# EAGLE design S0R (EAGLE 9.0.0)
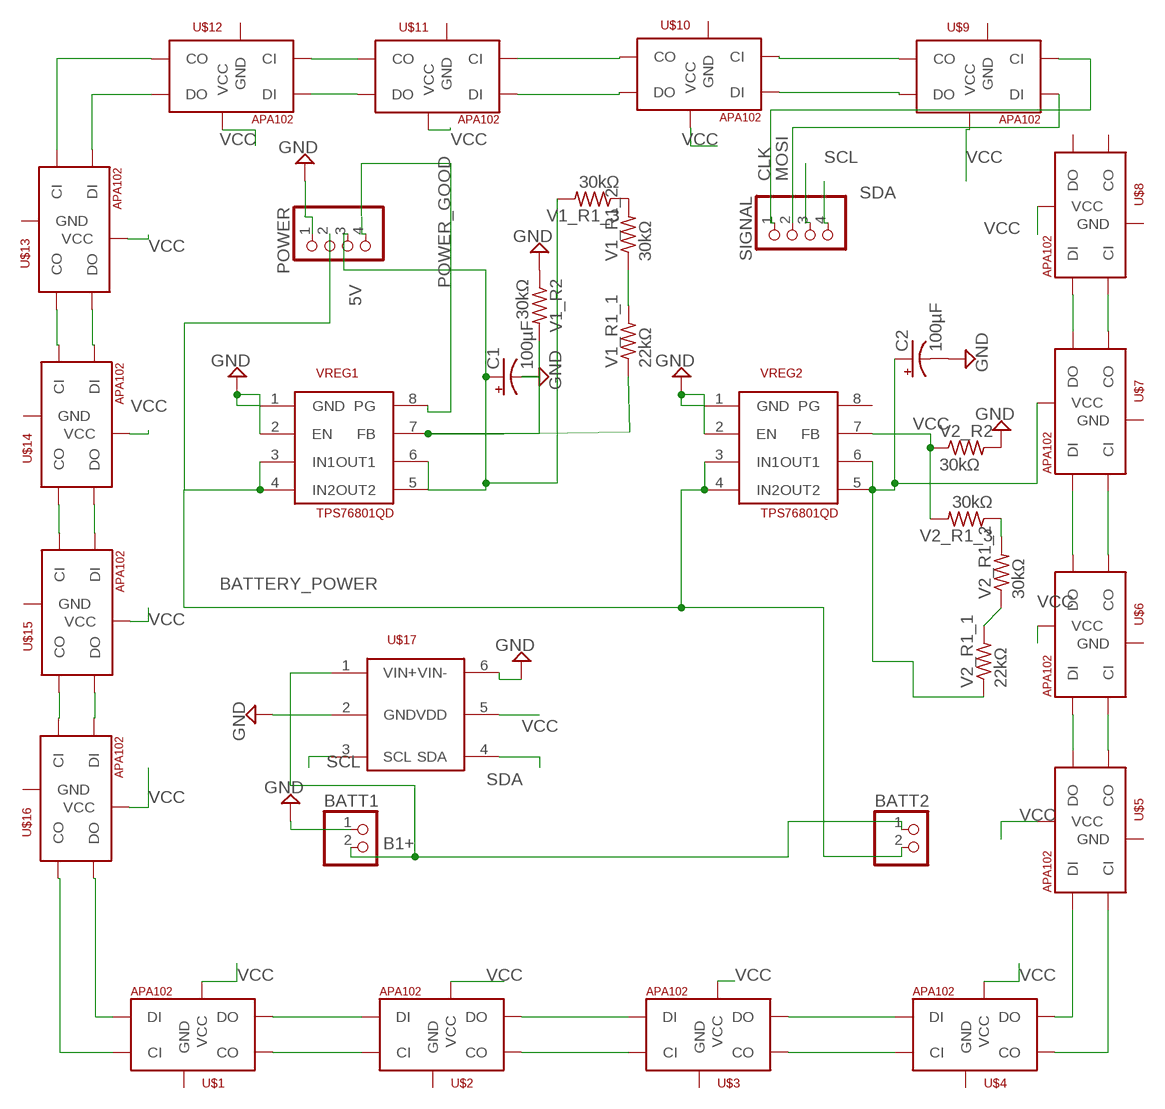
[diagram p0: schematic, sheet 1]

## Parts
BATT1  PINHD-1X2/90  [1X02/90]
BATT2  PINHD-1X2/90  [1X02/90]
C1  100µF  CPOL-USD/7343-31R  [D/7343-31R]
C2  100µF  CPOL-USD/7343-31R  [D/7343-31R]
POWER  PINHD-1X4  [1X04]
SIGNAL  PINHD-1X4  [1X04]
U$1  APA1025050  [APA102_5050]
U$2  APA1025050  [APA102_5050]
U$3  APA1025050  [APA102_5050]
U$4  APA1025050  [APA102_5050]
U$5  APA1025050  [APA102_5050]
U$6  APA1025050  [APA102_5050]
U$7  APA1025050  [APA102_5050]
U$8  APA1025050  [APA102_5050]
U$9  APA1025050  [APA102_5050]
U$10  APA1025050  [APA102_5050]
U$11  APA1025050  [APA102_5050]
U$12  APA1025050  [APA102_5050]
U$13  APA1025050  [APA102_5050]
U$14  APA1025050  [APA102_5050]
U$15  APA1025050  [APA102_5050]
U$16  APA1025050  [APA102_5050]
U$17  ADS1000BD0  [SOT-23-6-DBV]
V1_R1_1  22kΩ  R-US_R0402  [R0402]
V1_R1_2  30kΩ  R-US_M1206  [M1206]
V1_R1_3  30kΩ  R-US_M1206  [M1206]
V1_R2  30kΩ  R-US_M1206  [M1206]
V2_R1_1  22kΩ  R-US_R0402  [R0402]
V2_R1_2  30kΩ  R-US_M1206  [M1206]
V2_R1_3  30kΩ  R-US_M1206  [M1206]
V2_R2  30kΩ  R-US_M1206  [M1206]
VREG1  TPS76801QD  [SO-8_POWERPAD]
VREG2  TPS76801QD  [SO-8_POWERPAD]

## Nets
5V: C1.+ POWER.3 V1_R1_3.2 VREG1.5(OUT2) VREG1.6(OUT1)
B1+: BATT1.2 BATT2.1 U$17.1(VIN+)
BATTERY_POWER: BATT2.2 POWER.2 VREG1.3(IN1) VREG1.4(IN2) VREG2.3(IN1) VREG2.4(IN2)
CLK: SIGNAL.1 U$9.5(CI)
GND: BATT1.1 C1.- C2.- POWER.1 U$17.2(GND) U$17.6(VIN-) V1_R2.1 V2_R2.2 VREG1.1(GND) VREG1.2(EN) VREG2.1(GND) VREG2.2(EN)
MOSI: SIGNAL.2 U$9.4(DI)
N$3: U$1.3(DO) U$2.4(DI)
N$4: U$1.2(CO) U$2.5(CI)
N$5: U$2.3(DO) U$3.4(DI)
N$6: U$2.2(CO) U$3.5(CI)
N$7: U$3.3(DO) U$4.4(DI)
N$8: U$3.2(CO) U$4.5(CI)
N$9: U$4.3(DO) U$5.4(DI)
N$10: U$4.2(CO) U$5.5(CI)
N$11: U$5.2(CO) U$6.5(CI)
N$12: U$5.3(DO) U$6.4(DI)
N$13: U$6.3(DO) U$7.4(DI)
N$14: U$6.2(CO) U$7.5(CI)
N$15: U$7.2(CO) U$8.5(CI)
N$16: U$7.3(DO) U$8.4(DI)
N$17: U$1.5(CI) U$16.2(CO)
N$18: U$1.4(DI) U$16.3(DO)
N$19: U$9.3(DO) U$10.4(DI)
N$20: U$9.2(CO) U$10.5(CI)
N$21: U$10.2(CO) U$11.5(CI)
N$22: U$10.3(DO) U$11.4(DI)
N$23: U$11.2(CO) U$12.5(CI)
N$24: U$11.3(DO) U$12.4(DI)
N$25: U$12.2(CO) U$13.5(CI)
N$26: U$12.3(DO) U$13.4(DI)
N$27: U$13.3(DO) U$14.4(DI)
N$28: U$13.2(CO) U$14.5(CI)
N$29: U$14.3(DO) U$15.4(DI)
N$30: U$14.2(CO) U$15.5(CI)
N$31: U$15.2(CO) U$16.5(CI)
N$32: U$15.3(DO) U$16.4(DI)
N$33: V2_R1_2.2 V2_R1_3.1
N$35: V1_R1_1.2 V1_R1_2.1
N$37: V1_R1_1.1 V1_R2.2 VREG1.7(FB)
N$38: V1_R1_2.2 V1_R1_3.1
N$40: V2_R1_1.2 V2_R1_2.1
N$41: V2_R1_3.2 V2_R2.1 VREG2.7(FB)
POWER_GOOD: POWER.4 VREG1.8(PG)
SCL: SIGNAL.3 U$17.3(SCL)
SDA: SIGNAL.4 U$17.4(SDA)
VCC: C2.+ U$1.1(VCC) U$2.1(VCC) U$3.1(VCC) U$4.1(VCC) U$5.1(VCC) U$6.1(VCC) U$7.1(VCC) U$8.1(VCC) U$9.1(VCC) U$10.1(VCC) U$11.1(VCC) U$12.1(VCC) U$13.1(VCC) U$14.1(VCC) U$15.1(VCC) U$16.1(VCC) U$17.5(VDD) V2_R1_1.1 VREG2.5(OUT2) VREG2.6(OUT1)
Unconnected: U$8.2(CO) U$8.3(DO) VREG2.8(PG)

## Power pins joined to a net without a drawn wire
GND: U$1.6(GND) U$2.6(GND) U$3.6(GND) U$4.6(GND) U$5.6(GND) U$6.6(GND) U$7.6(GND) U$8.6(GND) U$9.6(GND) U$10.6(GND) U$11.6(GND) U$12.6(GND) U$13.6(GND) U$14.6(GND) U$15.6(GND) U$16.6(GND)

## Library data of the parts
BATT1 BATT2 = pinhead:PINHD-1X2: PIN HEADER
C1 C2 = rcl:CPOL-US: POLARIZED CAPACITOR, American symbol; SPICEPREFIX: C
POWER SIGNAL = pinhead:PINHD-1X4: PIN HEADER
U$1-U$16 = Parts:APA102: APA102C 5050 RGB LED -- Adafruit DotStar Single LED Pixel Product Page: https://www.adafruit.com/products/2343 Datasheet: https://cdn-shop.adafruit.com/product-files/2343/APA102C.pdf
U$17 = Parts:ADS1000
V1_R1_1 V2_R1_1 = rcl:R-US_: RESISTOR, American symbol; SPICEPREFIX: R
V1_R1_2 V1_R1_3 V1_R2 V2_R1_2 V2_R1_3 V2_R2 = resistor:R-US_: RESISTOR, American symbol
VREG1 VREG2 = Parts:TPS76801QD

## Board
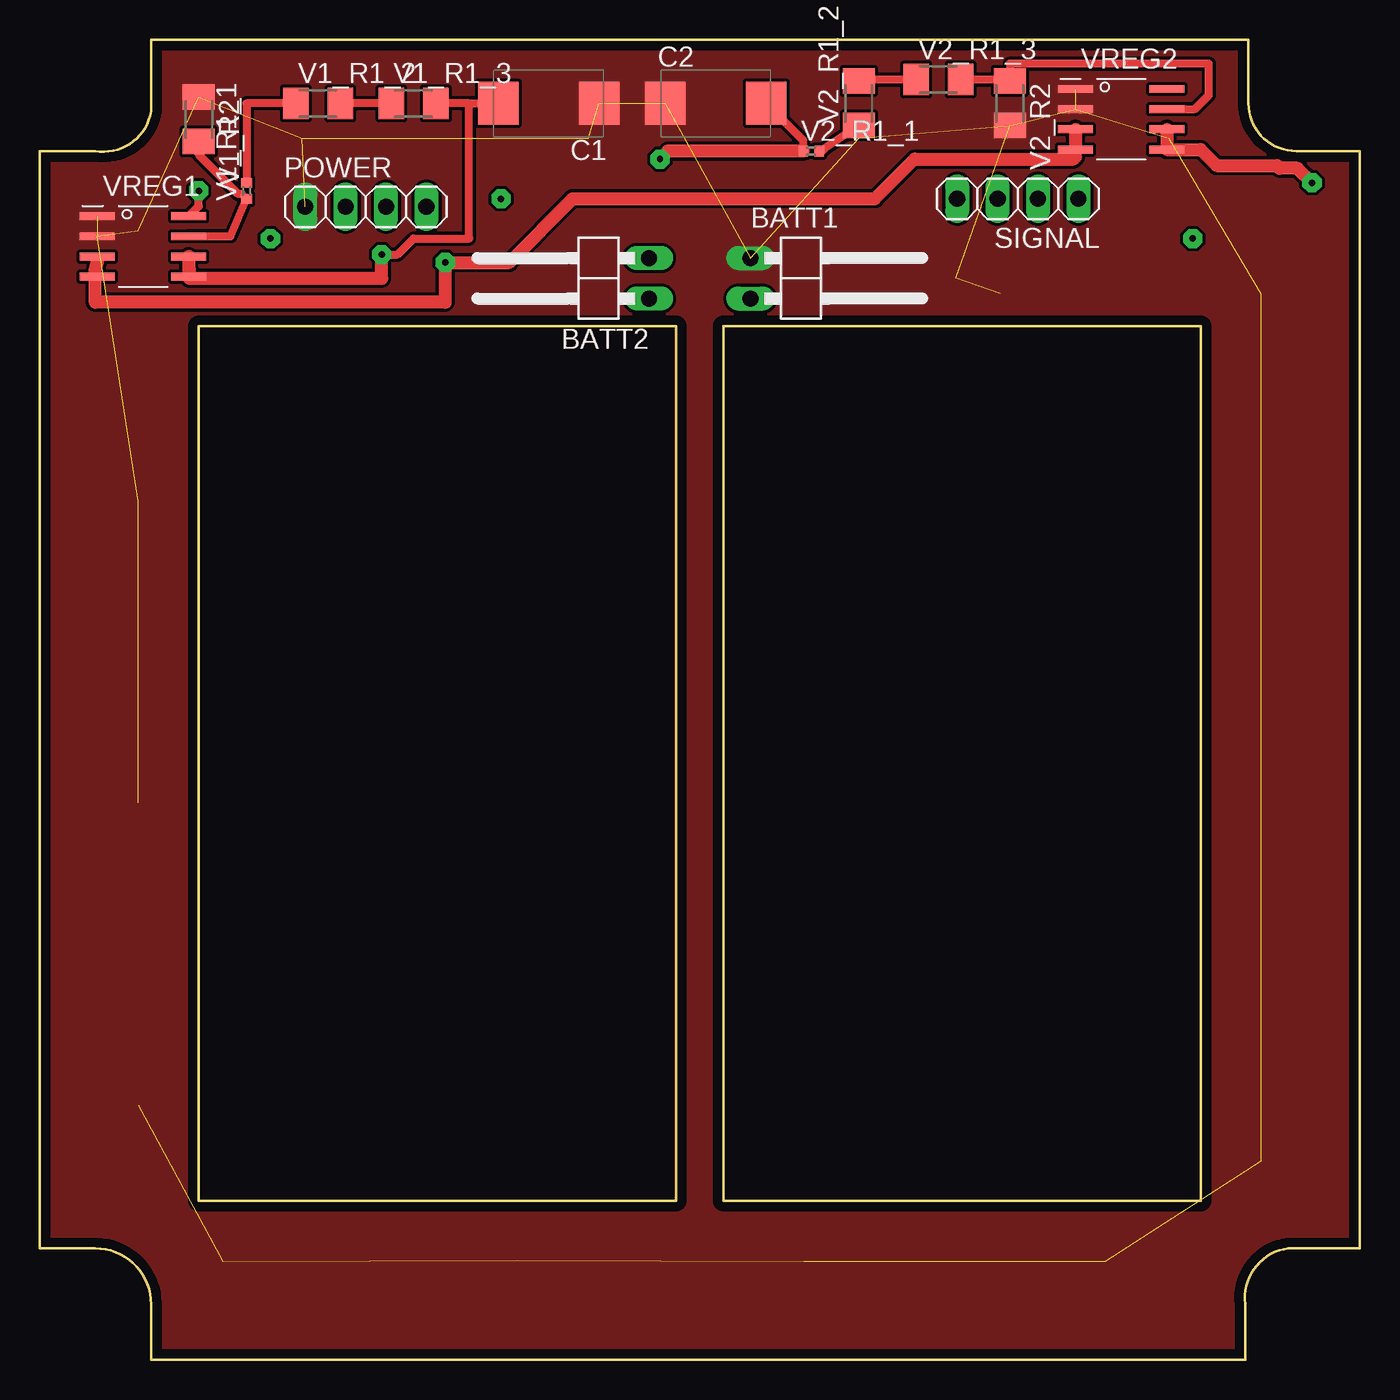
[diagram p1: board, top side]
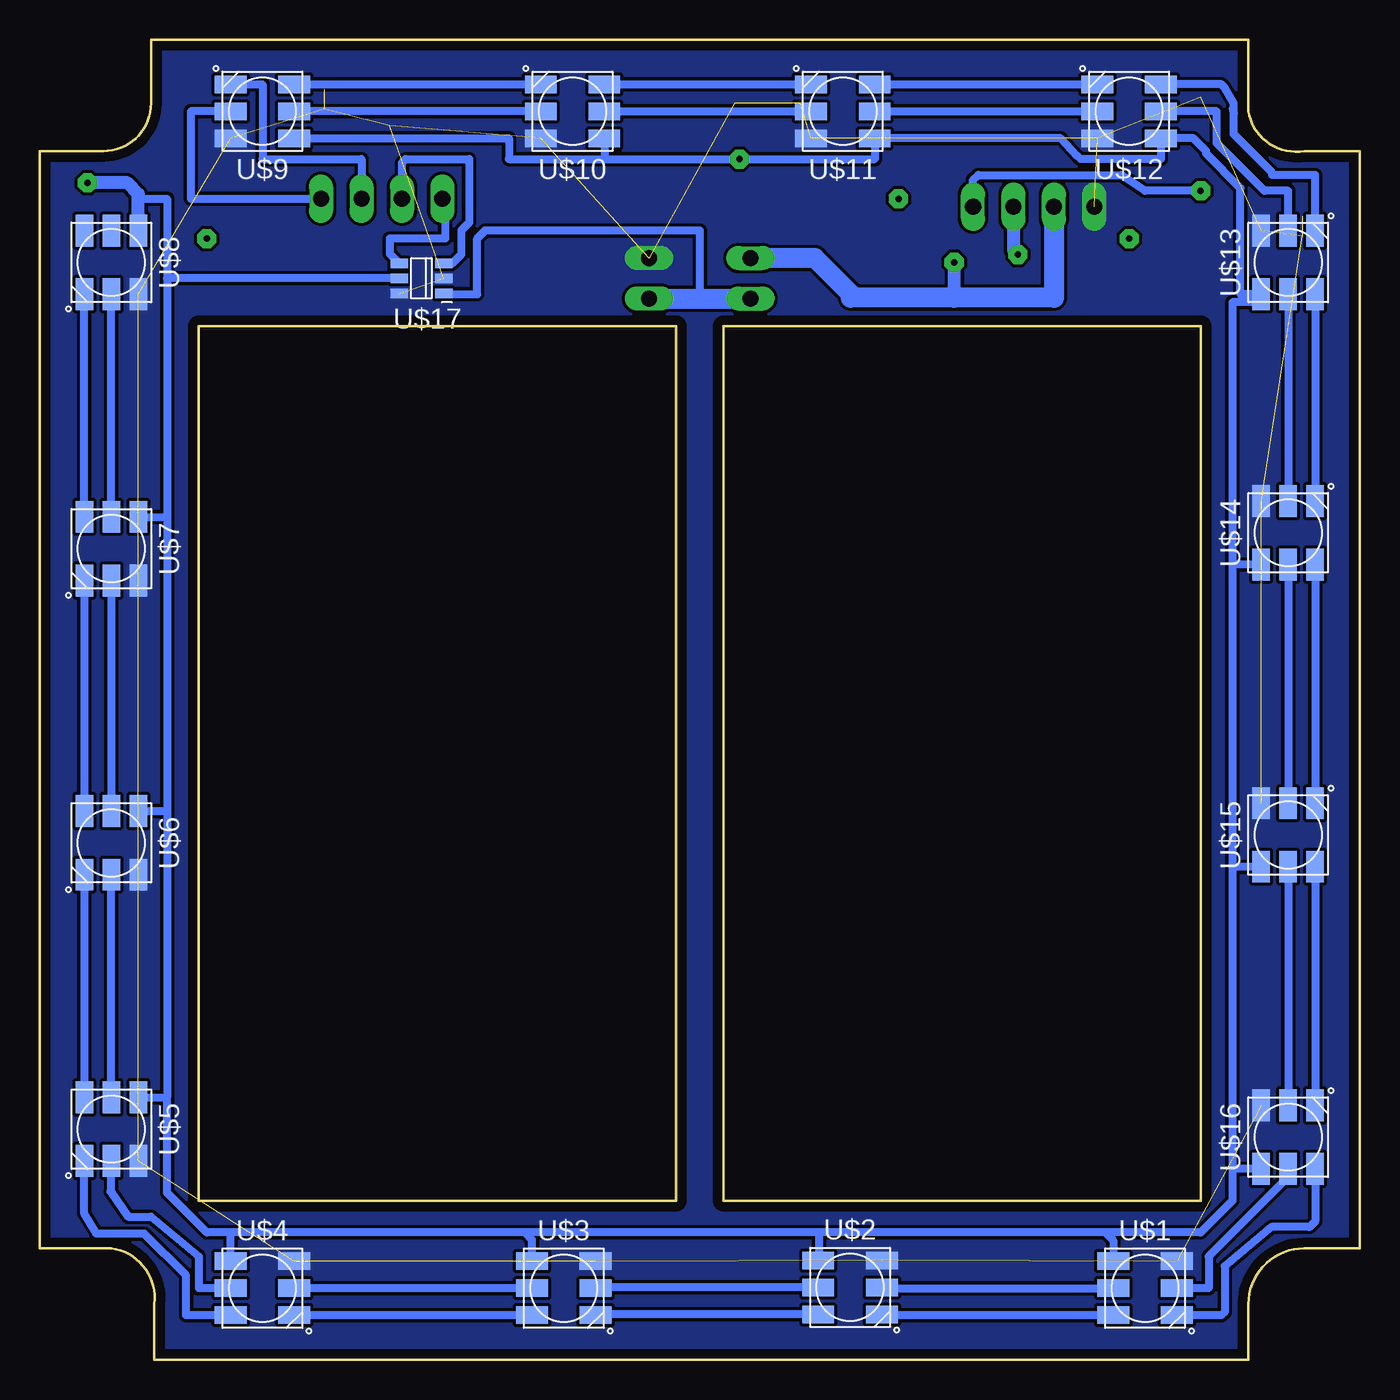
[diagram p2: board, bottom side, seen from below]

Size 83 x 83 mm. Coordinates in mm from the lower left corner, seen from the top.
Outline: 7,83 7,78.5 arc-90 3.5,76 0,76 0,7 3.5,7 arc-90 7,3.5 7,0 75.8,0 75.8,3.5 arc-90 78.5,7 83,7 83,76 79,76 arc-90 76,79 76,83 7,83
Outline: 10,65 40,65 40,10 10,10 10,65
Outline: 43,65 73,65 73,10 43,10 43,65
Copper layers (1*16): Top 0.035mm / dielectric 1.5mm / Bottom 0.035mm
Design rules "default *": minimum track width 6mil, minimum drill 0.35mm, track to track 6mil, track to pad 6mil, pad to pad 6mil, via to via 6mil, smd to smd 6mil, copper to edge 0.6mm, drill to drill 6mil, minimum pad ring 10mil, minimum via ring 8mil, stop-mask expansion 4mil, vias tented up to drill 0mil, thermal gap 10mil

### Footprints (pad centres in the part's own frame; a part is rotated, then mirrored left to right if it is on the bottom)
1X02/90 = drill 1.016 long: 1 -1.27,-3.81; 2 1.27,-3.81
D/7343-31R = smd 2.55 x 2.7: + 3.175,0; - -3.175,0
1X04 = drill 1.016 long: 1 -3.81,0; 2 -1.27,0; 3 1.27,0; 4 3.81,0
APA102_5050 = smd 2 x 1.1: 1 2,-1.7; 2 2,0; 3 2,1.7; 4 -2,1.7; 5 -2,0; 6 -2,-1.7
SOT-23-6-DBV = smd 0.6 x 1.1: 1 -0.95,-1.4; 2 0,-1.4; 3 0.95,-1.4; 4 0.95,1.4; 5 0,1.4; 6 -0.95,1.4
R0402 = smd 0.6 x 0.7: 1 -0.5,0; 2 0.5,0
M1206 = smd 1.6 x 2: 1 -1.4,0; 2 1.4,0
SO-8_POWERPAD = smd 0.5 x 2.2: 1 -1.905,-2.875; 2 -0.635,-2.875; 3 0.635,-2.875; 4 1.905,-2.875; 5 1.905,2.875; 6 0.635,2.875; 7 -0.635,2.875; 8 -1.905,2.875

### Placement (x,y rotation side)
BATT1  48.5,68 270 top
BATT2  34.5,68 90 top
C1  32,79 180 top
C2  42.5,79 0 top
POWER  20.5,72.5 0 top
SIGNAL  61.5,73 180 top
U$1  13.5,4.5 180 bottom
U$2  32.05,4.55 180 bottom
U$3  50.05,4.5 180 bottom
U$4  69,4.5 180 bottom
U$5  78.5,14.5 90 bottom
U$6  78.5,32.5 90 bottom
U$7  78.5,51 90 bottom
U$8  78.5,69 90 bottom
U$9  69,78.5 0 bottom
U$10  49.5,78.5 0 bottom
U$11  32.5,78.5 0 bottom
U$12  14.5,78.5 0 bottom
U$13  4.5,69 270 bottom
U$14  4.5,52 270 bottom
U$15  4.5,33 270 bottom
U$16  4.5,14 270 bottom
U$17  59,68 90 bottom
V1_R1_1  13,73.5 90 top
V1_R1_2  17.5,79 0 top
V1_R1_3  23.5,79 0 top
V1_R2  10,78 270 top
V2_R1_1  48.5,76 0 top
V2_R1_2  51.5,79 90 top
V2_R1_3  56.5,80.5 0 top
V2_R2  61,79 270 top
VREG1  6.5,70 270 top
VREG2  68,78 270 top

### Tracks (layer width: path | path; a pad name or v marks a point on that pad's centre or on a via)
5V  (via drill 0.4 pad 1.2)
  Top 0.508: v21.5,69.5 22.5,69.5 23.5,70.5 27,70.5 27,79 | 27,79 V1_R1_3.2 | 27,79 C1.+
  Top 0.813: VREG1.5 VREG1.6 9.41,68 21.5,68 v21.5,69.5
  Bottom 0.813: POWER.3 21.77,69.77 v21.5,69.5
B1+
  Bottom 0.508: 41.5,66.73 41.5,71 55,71 55.5,70.5 55.5,67 57.55,67 U$17.1
  Bottom 1.27: BATT1.2 41.5,66.73 BATT2.1
BATTERY_POWER  (via drill 0.4 pad 1.2)
  Top 0.508: VREG1.4 3.62,69 VREG1.3
  Top 0.813: 3.62,69 3.47,68.47 3.5,66.5 25.5,66.5 v25.5,69 29.5,69 33.5,73 52.5,73 55,75.5 65,75.5 65.12,75.62 VREG2.4 VREG2.3
  Bottom 0.813: 32,66.77 32,67 | 25.5,66.77 v25.5,69
  Bottom 1.27: POWER.2 19.23,66.77 25.5,66.77 32,66.77 | BATT2.2 34.27,69.27 32,67
CLK
  Bottom 0.508: U$9.5 73.5,78.5 73.5,73 SIGNAL.1
CLK1  (via drill 0.4 pad 1.2)
  other vias: 29,73
CLK2  (via drill 0.4 pad 1.2)
  other vias: 72.5,70.5
CLK3  (via drill 0.4 pad 1.2)
  other vias: 14.5,70.5
GND  (27 unrouted)
  pour Bottom (isolate 0.2, no thermals): 83,76 79,76 arc-80 76,78.5 76,83 7,83 7,79 arc-90 4,76 3.5,76 0,76 0,7 3.5,7 arc-90 7,3.5 7,0 75.8,0 75.8,4.05 arc-90 78.75,7 83,7
  pour Top (isolate 0.2, no thermals): 7,0 75.8,0 75.8,3.25 75.8,4 arc-90 78.8,7 83,7 83,76 79,76 arc-90 76,79 76,83 7,83 7,79 arc-90 4,76 3.5,76 0,76 0,7 3.5,7 arc-90 7,3.5
MOSI
  Bottom 0.508: U$9.4 69,80.2 69,75.5 62.77,75.5 SIGNAL.2
N$1
  Top 0.152: 43,65 73,65 73,10 43,10 43,65
N$2
  Top 0.152: 10,65 40,65 40,10 10,10 10,65
N$3
  Bottom 0.508: U$1.3 29.5,2.8 U$2.4
N$4
  Bottom 0.508: U$2.5 29.5,4.5 U$1.2
N$5
  Bottom 0.508: U$2.3 48,2.85 U$3.4
N$6
  Bottom 0.508: U$2.2 48,4.55 U$3.5
N$7
  Bottom 0.508: U$3.3 U$4.4
N$8
  Bottom 0.508: U$3.2 U$4.5
N$9
  Bottom 0.508: U$4.3 73.8,2.8 73.8,5.3 76.43,7.93 78.44,7.93 79.43,7.93 80.2,9.2 U$5.4
N$10
  Bottom 0.508: U$4.2 73,4.5 73,6.5 76,9 77.45,9 78.55,10.6 78.5,10.5 U$5.5
N$11
  Bottom 0.508: U$5.2 U$6.5
N$12
  Bottom 0.508: U$6.4 U$5.3
N$13
  Bottom 0.508: U$7.4 U$6.3
N$14
  Bottom 0.508: U$7.5 U$6.2
N$15
  Bottom 0.508: U$7.2 U$8.5
N$16
  Bottom 0.508: U$7.3 U$8.4
N$17
  Bottom 0.508: U$1.5 9.5,4.5 9.5,6.5 4.5,11.5 U$16.2
N$18
  Bottom 0.508: U$1.4 8.7,2.8 8.5,3 8.5,5.88 5.53,8.35 3.15,8.35 2.8,8.7 U$16.3
N$19
  Bottom 0.508: U$9.3 U$10.4
N$20
  Bottom 0.508: U$10.5 U$9.2
N$21
  Bottom 0.508: U$10.2 U$11.5
N$22
  Bottom 0.508: U$10.3 U$11.4
N$23
  Bottom 0.508: U$11.2 U$12.5
N$24
  Bottom 0.508: U$11.3 U$12.4
N$25
  Bottom 0.508: U$13.5 4.5,73.5 6,73.5 9,76.5 9,78.5 U$12.2
N$26
  Bottom 0.508: U$13.4 2.8,74.5 5.5,74.5 5.5,74.64 7.93,77.07 7.93,78.3 | 7.93,78.42 7.98,78.73 7.93,78.3 | 7.93,78.42 7.93,79 8.5,80 8.7,80.2 U$12.3 | 7.93,78.3 7.93,78.42
N$27
  Bottom 0.508: U$13.3 U$14.4
N$28
  Bottom 0.508: U$13.2 U$14.5
N$29
  Bottom 0.508: U$14.3 U$15.4
N$30
  Bottom 0.508: U$14.2 U$15.5
N$31
  Bottom 0.508: U$15.2 U$16.5
N$32
  Bottom 0.508: U$15.3 U$16.4
N$33
  Top 0.508: V2_R1_3.1 51.6,80.5 V2_R1_2.2
N$35
  Top 0.508: V1_R1_2.1 13,79 V1_R1_1.2
N$37
  Top 0.508: VREG1.7 12,70.64 V1_R1_1.1 12.71,73.29 12.48,73.29 10,75.78 V1_R2.2
N$38
  Top 0.508: V1_R1_3.1 V1_R1_2.2
N$40
  Top 0.508: V2_R1_2.1 49.38,76.19 | 49.38,76.19 49.1,76 | V2_R1_1.2 49.19,76 49.38,76.19
N$41
  Top 0.508: VREG2.7 72.64,78.64 73.5,79.5 73.5,81.5 61,81.5 V2_R2.1 60.9,80.5 V2_R1_3.2
POWER_GOOD  (via drill 0.4 pad 1.2)
  Top 0.508: VREG1.8 10,72.53 v10,73.5
  Bottom 0.508: v10,73.5 13.5,73.5 15,74.5 24,74.5 24.31,74.19 POWER.4
SCL
  Bottom 0.508: SIGNAL.3 60.23,75.27 60,75.5 56,75.5 56,71.5 56.5,71 56.5,69.5 57.05,68.95 U$17.3
SDA
  Bottom 0.508: SIGNAL.4 57.5,72.81 57.5,70.5 61,70.5 61,69.55 U$17.4
VCC  (via drill 0.4 pad 1.2)
  Top 0.508: C2.+ 48,76.67 V2_R1_1.1
  Top 0.813: v80,74 79.08,74.92 77.97,74.92 77.79,75.09 74,75.09 73,76.09 VREG2.5 VREG2.6 | V2_R1_1.1 39.5,76 v39,75.5
  Bottom 0.508: U$8.1 76.8,72 76.8,73 75,73 75,68 | 75,68 75,53 | 75,53 75,34.5 | 75,34.5 75,16.5 | U$5.1 75,16.5 | U$6.1 75,34.5 | U$7.1 75,53 | 47.5,75.5 v39,75.5 30.5,75.5 U$11.1 18.8,76.8 17.74,75.69 17.55,75.5 12.5,75.5 U$12.1 10.46,76.8 9.66,76 9.66,75.84 7.5,73.68 7.5,67 U$13.1 6.7,66.5 8,66.5 8,50 | U$10.1 47.5,75.5 | 8,50 8,31 | 8,31 8,12 | 8,12 8,10 10,8 16,8 | 16,8 34,8 | 34,8 52.5,8 | 52.5,8 71,8 | 71,8 72.5,8 75,10.5 75,16.5 | U$16.1 8,12 | 16,8 15.5,7.5 U$1.1 | U$4.1 71,8 | U$9.1 53.5,76.8 53.5,75.5 47.5,75.5 | U$15.1 8,31 | U$17.5 75,68 | U$14.1 8,50 | 34,8 34,6.3 U$2.1 | U$3.1 52.05,7.55 52.5,8
  Bottom 0.813: 76.8,72 76.8,73.3 77.5,74 v80,74